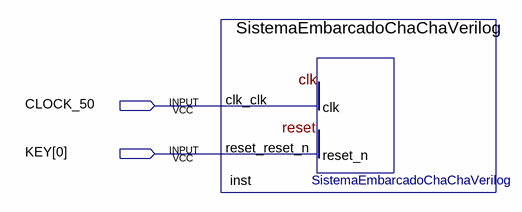
[diagram p0: schematic sheet]
// Quartus schematic ChaChaVerilog.bdf as structural Verilog: 1 symbols, 2 pins
module ChaChaVerilog (
  input  CLOCK_50,
  input  [0:0] KEY
);

  SistemaEmbarcadoChaChaVerilog inst (.clk_clk(CLOCK_50), .reset_reset_n(KEY[0]));
endmodule
